# Altium schematic sheet P07 CPU_3.SchDoc
size 386 x 246 mm
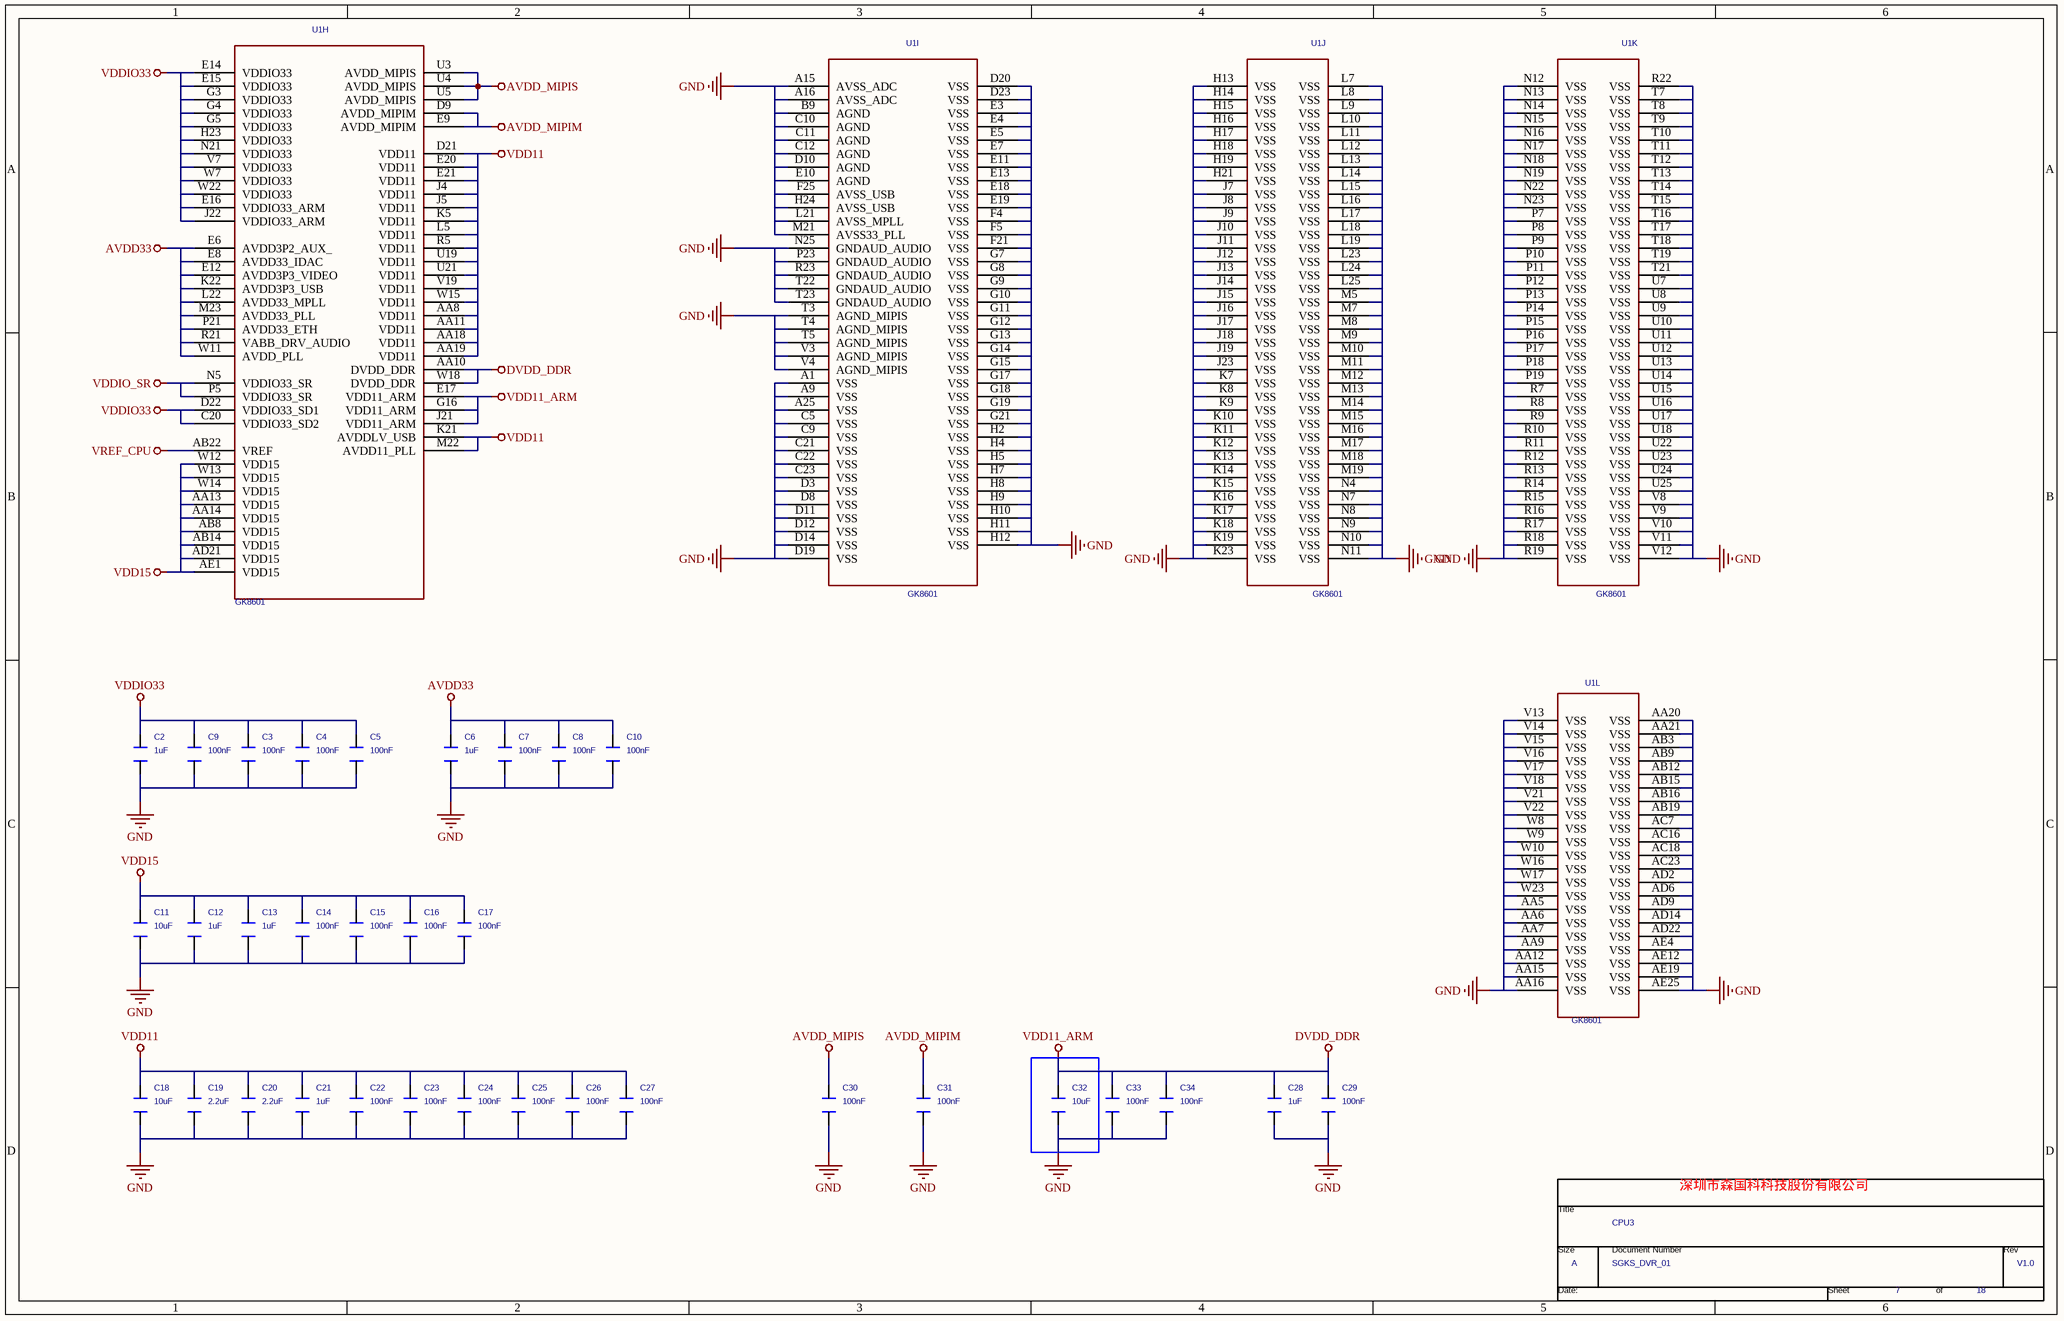
[diagram p0: P07 CPU_3.SchDoc]

## Parts
*  Page Count: 18  Page Number: 7  Page Size: A  Title: CPU3  RevCode: V1.0  Doc: SGKS_DVR_01  (hidden comment: TitleBlock0)  (graphical)
C2  1uF  [C0402]
C3  100nF  [C0402]
C4  100nF  [C0402]
C5  100nF  [C0402]
C6  1uF  [C0402]
C7  100nF  [C0402]
C8  100nF  [C0402]
C9  100nF  [C0402]
C10  100nF  [C0402]
C11  10uF  [C0603]
C12  1uF  [C0402]
C13  1uF  [C0402]
C14  100nF  [C0402]
C15  100nF  [C0402]
C16  100nF  [C0402]
C17  100nF  [C0402]
C18  10uF  [C0603]
C19  2.2uF  [C0402]
C20  2.2uF  [C0402]
C21  1uF  [C0402]
C22  100nF  [C0402]
C23  100nF  [C0402]
C24  100nF  [C0402]
C25  100nF  [C0402]
C26  100nF  [C0402]
C27  100nF  [C0402]
C28  1uF  [C0402]
C29  100nF  [C0402]
C30  100nF  [C0402]
C31  100nF  [C0402]
C32  10uF  [C0603]
C33  100nF  [C0402]
C34  100nF  [C0402]
U1  GK8601  [FBGA-569-0.65-17X17]  (parts H,I,J,K,L of 12)

## Nets
AVDD33: C6.2 C7.2 C8.2 C10.2 U1.E6(AVDD3P2_AUX_) U1.E8(AVDD33_IDAC) U1.E12(AVDD3P3_VIDEO) U1.K22(AVDD3P3_USB) U1.L22(AVDD33_MPLL) U1.M23(AVDD33_PLL) U1.P21(AVDD33_ETH) U1.R21(VABB_DRV_AUDIO) U1.W11(AVDD_PLL)
AVDD_MIPIM: C31.2 U1.D9(AVDD_MIPIM) U1.E9(AVDD_MIPIM)
AVDD_MIPIS: C30.2 U1.U3(AVDD_MIPIS) U1.U4(AVDD_MIPIS) U1.U5(AVDD_MIPIS)
DVDD_DDR: C28.2 C29.2 C32.2 C33.2 C34.2 U1.AA10(DVDD_DDR) U1.E17(VDD11_ARM) U1.G16(VDD11_ARM) U1.J21(VDD11_ARM) U1.W18(DVDD_DDR)  [also labelled VDD11_ARM]
GND: C2.1 C3.1 C4.1 C5.1 C6.1 C7.1 C8.1 C9.1 C10.1 C11.1 C12.1 C13.1 C14.1 C15.1 C16.1 C17.1 C18.1 C19.1 C20.1 C21.1 C22.1 C23.1 C24.1 C25.1 C26.1 C27.1 C28.1 C29.1 C30.1 C31.1 C32.1 C33.1 C34.1 U1.A1(VSS) U1.A9(VSS) U1.A15(AVSS_ADC) U1.A16(AVSS_ADC) U1.A25(VSS) U1.AA5(VSS) U1.AA6(VSS) U1.AA7(VSS) U1.AA9(VSS) U1.AA12(VSS) U1.AA15(VSS) U1.AA16(VSS) U1.AA20(VSS) U1.AA21(VSS) U1.AB3(VSS) U1.AB9(VSS) U1.AB12(VSS) U1.AB15(VSS) U1.AB16(VSS) U1.AB19(VSS) U1.AC7(VSS) U1.AC16(VSS) U1.AC18(VSS) U1.AC23(VSS) U1.AD2(VSS) U1.AD6(VSS) U1.AD9(VSS) U1.AD14(VSS) U1.AD22(VSS) U1.AE4(VSS) U1.AE12(VSS) U1.AE19(VSS) U1.AE25(VSS) U1.B9(AGND) U1.C5(VSS) U1.C9(VSS) U1.C10(AGND) U1.C11(AGND) U1.C12(AGND) U1.C21(VSS) U1.C22(VSS) U1.C23(VSS) U1.D3(VSS) U1.D8(VSS) U1.D10(AGND) U1.D11(VSS) U1.D12(VSS) U1.D14(VSS) U1.D19(VSS) U1.D20(VSS) U1.D23(VSS) U1.E3(VSS) U1.E4(VSS) U1.E5(VSS) U1.E7(VSS) U1.E10(AGND) U1.E11(VSS) U1.E13(VSS) U1.E18(VSS) U1.E19(VSS) U1.F4(VSS) U1.F5(VSS) U1.F21(VSS) U1.F25(AVSS_USB) U1.G7(VSS) U1.G8(VSS) U1.G9(VSS) U1.G10(VSS) U1.G11(VSS) U1.G12(VSS) U1.G13(VSS) U1.G14(VSS) U1.G15(VSS) U1.G17(VSS) U1.G18(VSS) U1.G19(VSS) U1.G21(VSS) U1.H2(VSS) U1.H4(VSS) U1.H5(VSS) U1.H7(VSS) U1.H8(VSS) U1.H9(VSS) U1.H10(VSS) U1.H11(VSS) U1.H12(VSS) U1.H13(VSS) U1.H14(VSS) U1.H15(VSS) U1.H16(VSS) U1.H17(VSS) U1.H18(VSS) U1.H19(VSS) U1.H21(VSS) U1.H24(AVSS_USB) U1.J7(VSS) U1.J8(VSS) U1.J9(VSS) U1.J10(VSS) U1.J11(VSS) U1.J12(VSS) U1.J13(VSS) U1.J14(VSS) U1.J15(VSS) U1.J16(VSS) U1.J17(VSS) U1.J18(VSS) U1.J19(VSS) U1.J23(VSS) U1.K7(VSS) U1.K8(VSS) U1.K9(VSS) U1.K10(VSS) U1.K11(VSS) U1.K12(VSS) U1.K13(VSS) U1.K14(VSS) U1.K15(VSS) U1.K16(VSS) U1.K17(VSS) U1.K18(VSS) U1.K19(VSS) U1.K23(VSS) U1.L7(VSS) U1.L8(VSS) U1.L9(VSS) U1.L10(VSS) U1.L11(VSS) U1.L12(VSS) U1.L13(VSS) U1.L14(VSS) U1.L15(VSS) U1.L16(VSS) U1.L17(VSS) U1.L18(VSS) U1.L19(VSS) U1.L21(AVSS_MPLL) U1.L23(VSS) U1.L24(VSS) U1.L25(VSS) U1.M5(VSS) U1.M7(VSS) U1.M8(VSS) U1.M9(VSS) U1.M10(VSS) U1.M11(VSS) U1.M12(VSS) U1.M13(VSS) U1.M14(VSS) U1.M15(VSS) U1.M16(VSS) U1.M17(VSS) U1.M18(VSS) U1.M19(VSS) U1.M21(AVSS33_PLL) U1.N4(VSS) U1.N7(VSS) U1.N8(VSS) U1.N9(VSS) U1.N10(VSS) U1.N11(VSS) U1.N12(VSS) U1.N13(VSS) U1.N14(VSS) U1.N15(VSS) U1.N16(VSS) U1.N17(VSS) U1.N18(VSS) U1.N19(VSS) U1.N22(VSS) U1.N23(VSS) U1.N25(GNDAUD_AUDIO) U1.P7(VSS) U1.P8(VSS) U1.P9(VSS) U1.P10(VSS) U1.P11(VSS) U1.P12(VSS) U1.P13(VSS) U1.P14(VSS) U1.P15(VSS) U1.P16(VSS) U1.P17(VSS) U1.P18(VSS) U1.P19(VSS) U1.P23(GNDAUD_AUDIO) U1.R7(VSS) U1.R8(VSS) U1.R9(VSS) U1.R10(VSS) U1.R11(VSS) U1.R12(VSS) U1.R13(VSS) U1.R14(VSS) U1.R15(VSS) U1.R16(VSS) U1.R17(VSS) U1.R18(VSS) U1.R19(VSS) U1.R22(VSS) U1.R23(GNDAUD_AUDIO) U1.T3(AGND_MIPIS) U1.T4(AGND_MIPIS) U1.T5(AGND_MIPIS) U1.T7(VSS) U1.T8(VSS) U1.T9(VSS) U1.T10(VSS) U1.T11(VSS) U1.T12(VSS) U1.T13(VSS) U1.T14(VSS) U1.T15(VSS) U1.T16(VSS) U1.T17(VSS) U1.T18(VSS) U1.T19(VSS) U1.T21(VSS) U1.T22(GNDAUD_AUDIO) U1.T23(GNDAUD_AUDIO) U1.U7(VSS) U1.U8(VSS) U1.U9(VSS) U1.U10(VSS) U1.U11(VSS) U1.U12(VSS) U1.U13(VSS) U1.U14(VSS) U1.U15(VSS) U1.U16(VSS) U1.U17(VSS) U1.U18(VSS) U1.U22(VSS) U1.U23(VSS) U1.U24(VSS) U1.U25(VSS) U1.V3(AGND_MIPIS) U1.V4(AGND_MIPIS) U1.V8(VSS) U1.V9(VSS) U1.V10(VSS) U1.V11(VSS) U1.V12(VSS) U1.V13(VSS) U1.V14(VSS) U1.V15(VSS) U1.V16(VSS) U1.V17(VSS) U1.V18(VSS) U1.V21(VSS) U1.V22(VSS) U1.W8(VSS) U1.W9(VSS) U1.W10(VSS) U1.W16(VSS) U1.W17(VSS) U1.W23(VSS)
VDD11: C18.2 C19.2 C20.2 C21.2 C22.2 C23.2 C24.2 C25.2 C26.2 C27.2 U1.AA8(VDD11) U1.AA11(VDD11) U1.AA18(VDD11) U1.AA19(VDD11) U1.D21(VDD11) U1.E20(VDD11) U1.E21(VDD11) U1.J4(VDD11) U1.J5(VDD11) U1.K5(VDD11) U1.K21(AVDDLV_USB) U1.L5(VDD11) U1.M22(AVDD11_PLL) U1.R5(VDD11) U1.U19(VDD11) U1.U21(VDD11) U1.V19(VDD11) U1.W15(VDD11)
VDD15: C11.2 C12.2 C13.2 C14.2 C15.2 C16.2 C17.2 U1.AA13(VDD15) U1.AA14(VDD15) U1.AB8(VDD15) U1.AB14(VDD15) U1.AD21(VDD15) U1.AE1(VDD15) U1.W12(VDD15) U1.W13(VDD15) U1.W14(VDD15)
VDDIO33: C2.2 C3.2 C4.2 C5.2 C9.2 U1.C20(VDDIO33_SD2) U1.D22(VDDIO33_SD1) U1.E14(VDDIO33) U1.E15(VDDIO33) U1.E16(VDDIO33_ARM) U1.G3(VDDIO33) U1.G4(VDDIO33) U1.G5(VDDIO33) U1.H23(VDDIO33) U1.J22(VDDIO33_ARM) U1.N21(VDDIO33) U1.V7(VDDIO33) U1.W7(VDDIO33) U1.W22(VDDIO33)
VDDIO_SR: U1.N5(VDDIO33_SR) U1.P5(VDDIO33_SR)
VREF_CPU: U1.AB22(VREF)

## Notes on the sheet
- 深圳市森国科科技股份有限公司
- (in symbol TitleBlock0) Title; Size; Document Number; Rev; Date:; Sheet; of

## Library data of the parts
C2-C34 = CAPACITOR: PAGE: 1
U1 = GK8601_12
* = TitleBlock0: Page Create Date: March  8, 1995